# EAGLE schematic newPins-primitive (EAGLE 9.6.2)
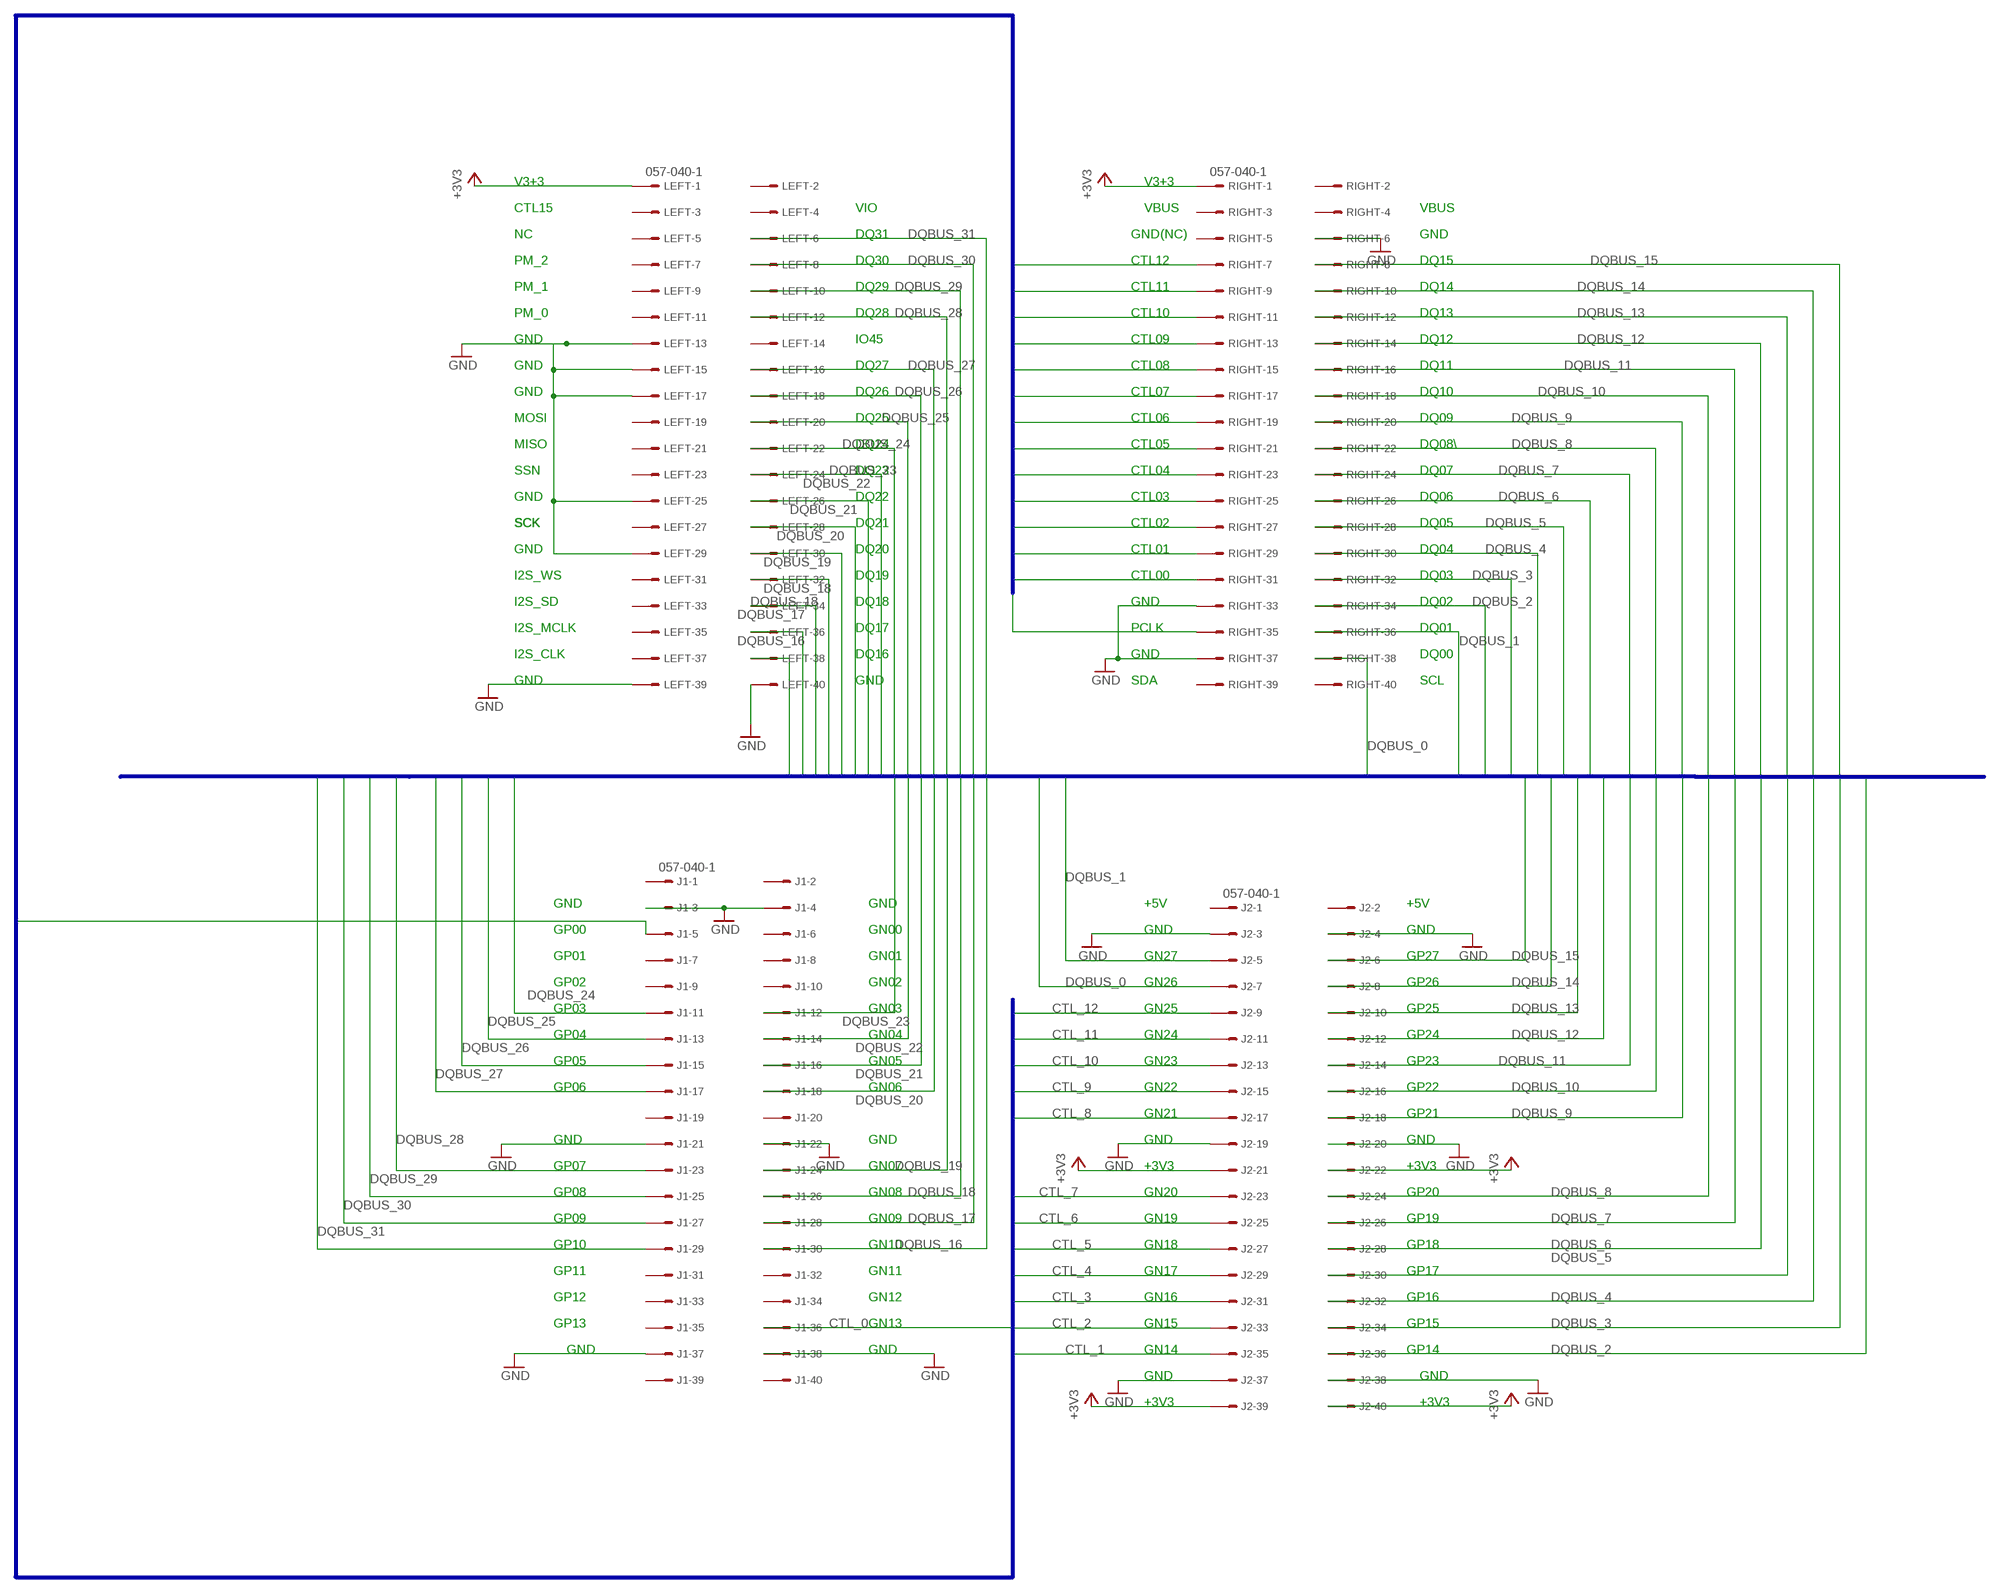
[diagram p0: schematic, sheet 1]

## Parts
J1  057-040-1  [057-040-1]
J2  057-040-1  [057-040-1]
LEFT  057-040-1  [057-040-1]
RIGHT  057-040-1  [057-040-1]

## Nets
+3V3: J2.21 J2.22 J2.39 J2.40 LEFT.1 RIGHT.1
CTL_0: J1.36 RIGHT.31
CTL_1: J2.35 RIGHT.29
CTL_2: J2.33 RIGHT.27
CTL_3: J2.31 RIGHT.25
CTL_4: J2.29 RIGHT.23
CTL_5: J2.27 RIGHT.21
CTL_6: J2.25 RIGHT.19
CTL_7: J2.23 RIGHT.17
CTL_8: J2.17 RIGHT.15
CTL_9: J2.15 RIGHT.13
CTL_10: J2.13 RIGHT.11
CTL_11: J2.11 RIGHT.9
CTL_12: J2.9 RIGHT.7
CTL_PCLK: J1.5 RIGHT.35
DQBUS_0: J2.7 RIGHT.38
DQBUS_1: J2.5 RIGHT.36
DQBUS_2: J2.36 RIGHT.34
DQBUS_3: J2.34 RIGHT.32
DQBUS_4: J2.32 RIGHT.30
DQBUS_5: J2.30 RIGHT.28
DQBUS_6: J2.28 RIGHT.26
DQBUS_7: J2.26 RIGHT.24
DQBUS_8: J2.24 RIGHT.22
DQBUS_9: J2.18 RIGHT.20
DQBUS_10: J2.16 RIGHT.18
DQBUS_11: J2.14 RIGHT.16
DQBUS_12: J2.12 RIGHT.14
DQBUS_13: J2.10 RIGHT.12
DQBUS_14: J2.8 RIGHT.10
DQBUS_15: J2.6 RIGHT.8
DQBUS_16: J1.30 LEFT.38
DQBUS_17: J1.28 LEFT.36
DQBUS_18: J1.26 LEFT.34
DQBUS_19: J1.24 LEFT.32
DQBUS_20: J1.18 LEFT.30
DQBUS_21: J1.16 LEFT.28
DQBUS_22: J1.14 LEFT.26
DQBUS_23: J1.12 LEFT.24
DQBUS_24: J1.11 LEFT.22
DQBUS_25: J1.13 LEFT.20
DQBUS_26: J1.15 LEFT.18
DQBUS_27: J1.17 LEFT.16
DQBUS_28: J1.23 LEFT.12
DQBUS_29: J1.25 LEFT.10
DQBUS_30: J1.27 LEFT.8
DQBUS_31: J1.29 LEFT.6
GND: J1.3 J1.4 J1.21 J1.22 J1.37 J1.38 J2.3 J2.4 J2.19 J2.20 J2.37 J2.38 LEFT.13 LEFT.15 LEFT.17 LEFT.25 LEFT.29 LEFT.39 LEFT.40 RIGHT.6 RIGHT.33 RIGHT.37
Unconnected: J1.1 J1.2 J1.6 J1.7 J1.8 J1.9 J1.10 J1.19 J1.20 J1.31 J1.32 J1.33 J1.34 J1.35 J1.39 J1.40 J2.1 J2.2 LEFT.2 LEFT.3 LEFT.4 LEFT.5 LEFT.7 LEFT.9 LEFT.11 LEFT.14 LEFT.19 LEFT.21 LEFT.23 LEFT.27 LEFT.31 LEFT.33 LEFT.35 LEFT.37 RIGHT.2 RIGHT.3 RIGHT.4 RIGHT.5 RIGHT.39 RIGHT.40

## Buses
DQBUS:DQBUS_0,DQBUS_1,DQBUS_2,DQBUS_3,DQBUS_4,DQBUS_5,DQBUS_6,DQBUS_7,DQBUS_8,DQBUS_9,DQBUS_10,DQBUS_11,DQBUS_12,DQBUS_13,DQBUS_14,DQBUS_15,DQBUS_16,DQBUS_17,DQBUS_18,DQBUS_19,DQBUS_20,DQBUS_21,DQBUS_22,DQBUS_23,DQBUS_24,DQBUS_25,DQBUS_26,DQBUS_27,DQBUS_28,DQBUS_29,DQBUS_30,DQBUS_31
CTL:CTL_0,CTL_1,CTL_2,CTL_3,CTL_4,CTL_5,CTL_6,CTL_7,CTL_8,CTL_9,CTL_10,CTL_11,CTL_12,CTL_PCLK

## Notes on the sheet
- V3+3 | V3+3
- CTL15 | VIO | VBUS | VBUS
- NC | DQ31 | GND(NC) | GND
- PM_2 | DQ30 | CTL12 | DQ15
- PM_1 | DQ29 | CTL11 | DQ14
- PM_0 | DQ28 | CTL10 | DQ13
- GND | IO45 | CTL09 | DQ12
- GND | DQ27 | CTL08 | DQ11
- GND | DQ26 | CTL07 | DQ10
- MOSI | DQ25 | CTL06 | DQ09
- MISO | DQ24 | CTL05 | DQ08\
- SSN | DQ23 | CTL04 | DQ07
- GND | DQ22 | CTL03 | DQ06
- SCK | SCK | DQ21 | CTL02 | DQ05
- GND | DQ20 | CTL01 | DQ04
- I2S_WS | DQ19 | CTL00 | DQ03
- I2S_SD | DQ18 | GND | DQ02
- I2S_MCLK | DQ17 | PCLK | DQ01
- I2S_CLK | DQ16 | GND | DQ00
- GND | GND | SDA | SCL
- GND | GND | +5V | +5V
- GP00 | GN00 | GND | GND
- GP01 | GN01 | GN27 | GP27
- GP02 | GN02 | GN26 | GP26
- GP03 | GN03 | GN25 | GP25
- GP04 | GN04 | GN24 | GP24
- GP05 | GN05 | GN23 | GP23
- GP06 | GN06 | GN22 | GP22
- GN21 | GP21
- GND | GND | GND | GND
- GP07 | GN07 | +3V3 | +3V3
- GP08 | GN08 | GN20 | GP20
- GP09 | GN09 | GN19 | GP19
- GP10 | GN10 | GN18 | GP18
- GP11 | GN11 | GN17 | GP17
- GP12 | GN12 | GN16 | GP16
- GP13 | GN13 | GN15 | GP15
- GND | GND | GN14 | GP14
- GND | GND
- +3V3 | +3V3

## Library data of the parts
J1 J2 LEFT RIGHT = con-panduit:057-040-: CONNECTOR 40-pin series 057 contact pc board low profile headers; OC_FARNELL: unknown; OC_NEWARK: unknown